# EAGLE schematic JKW_standalone (EAGLE 6.4)
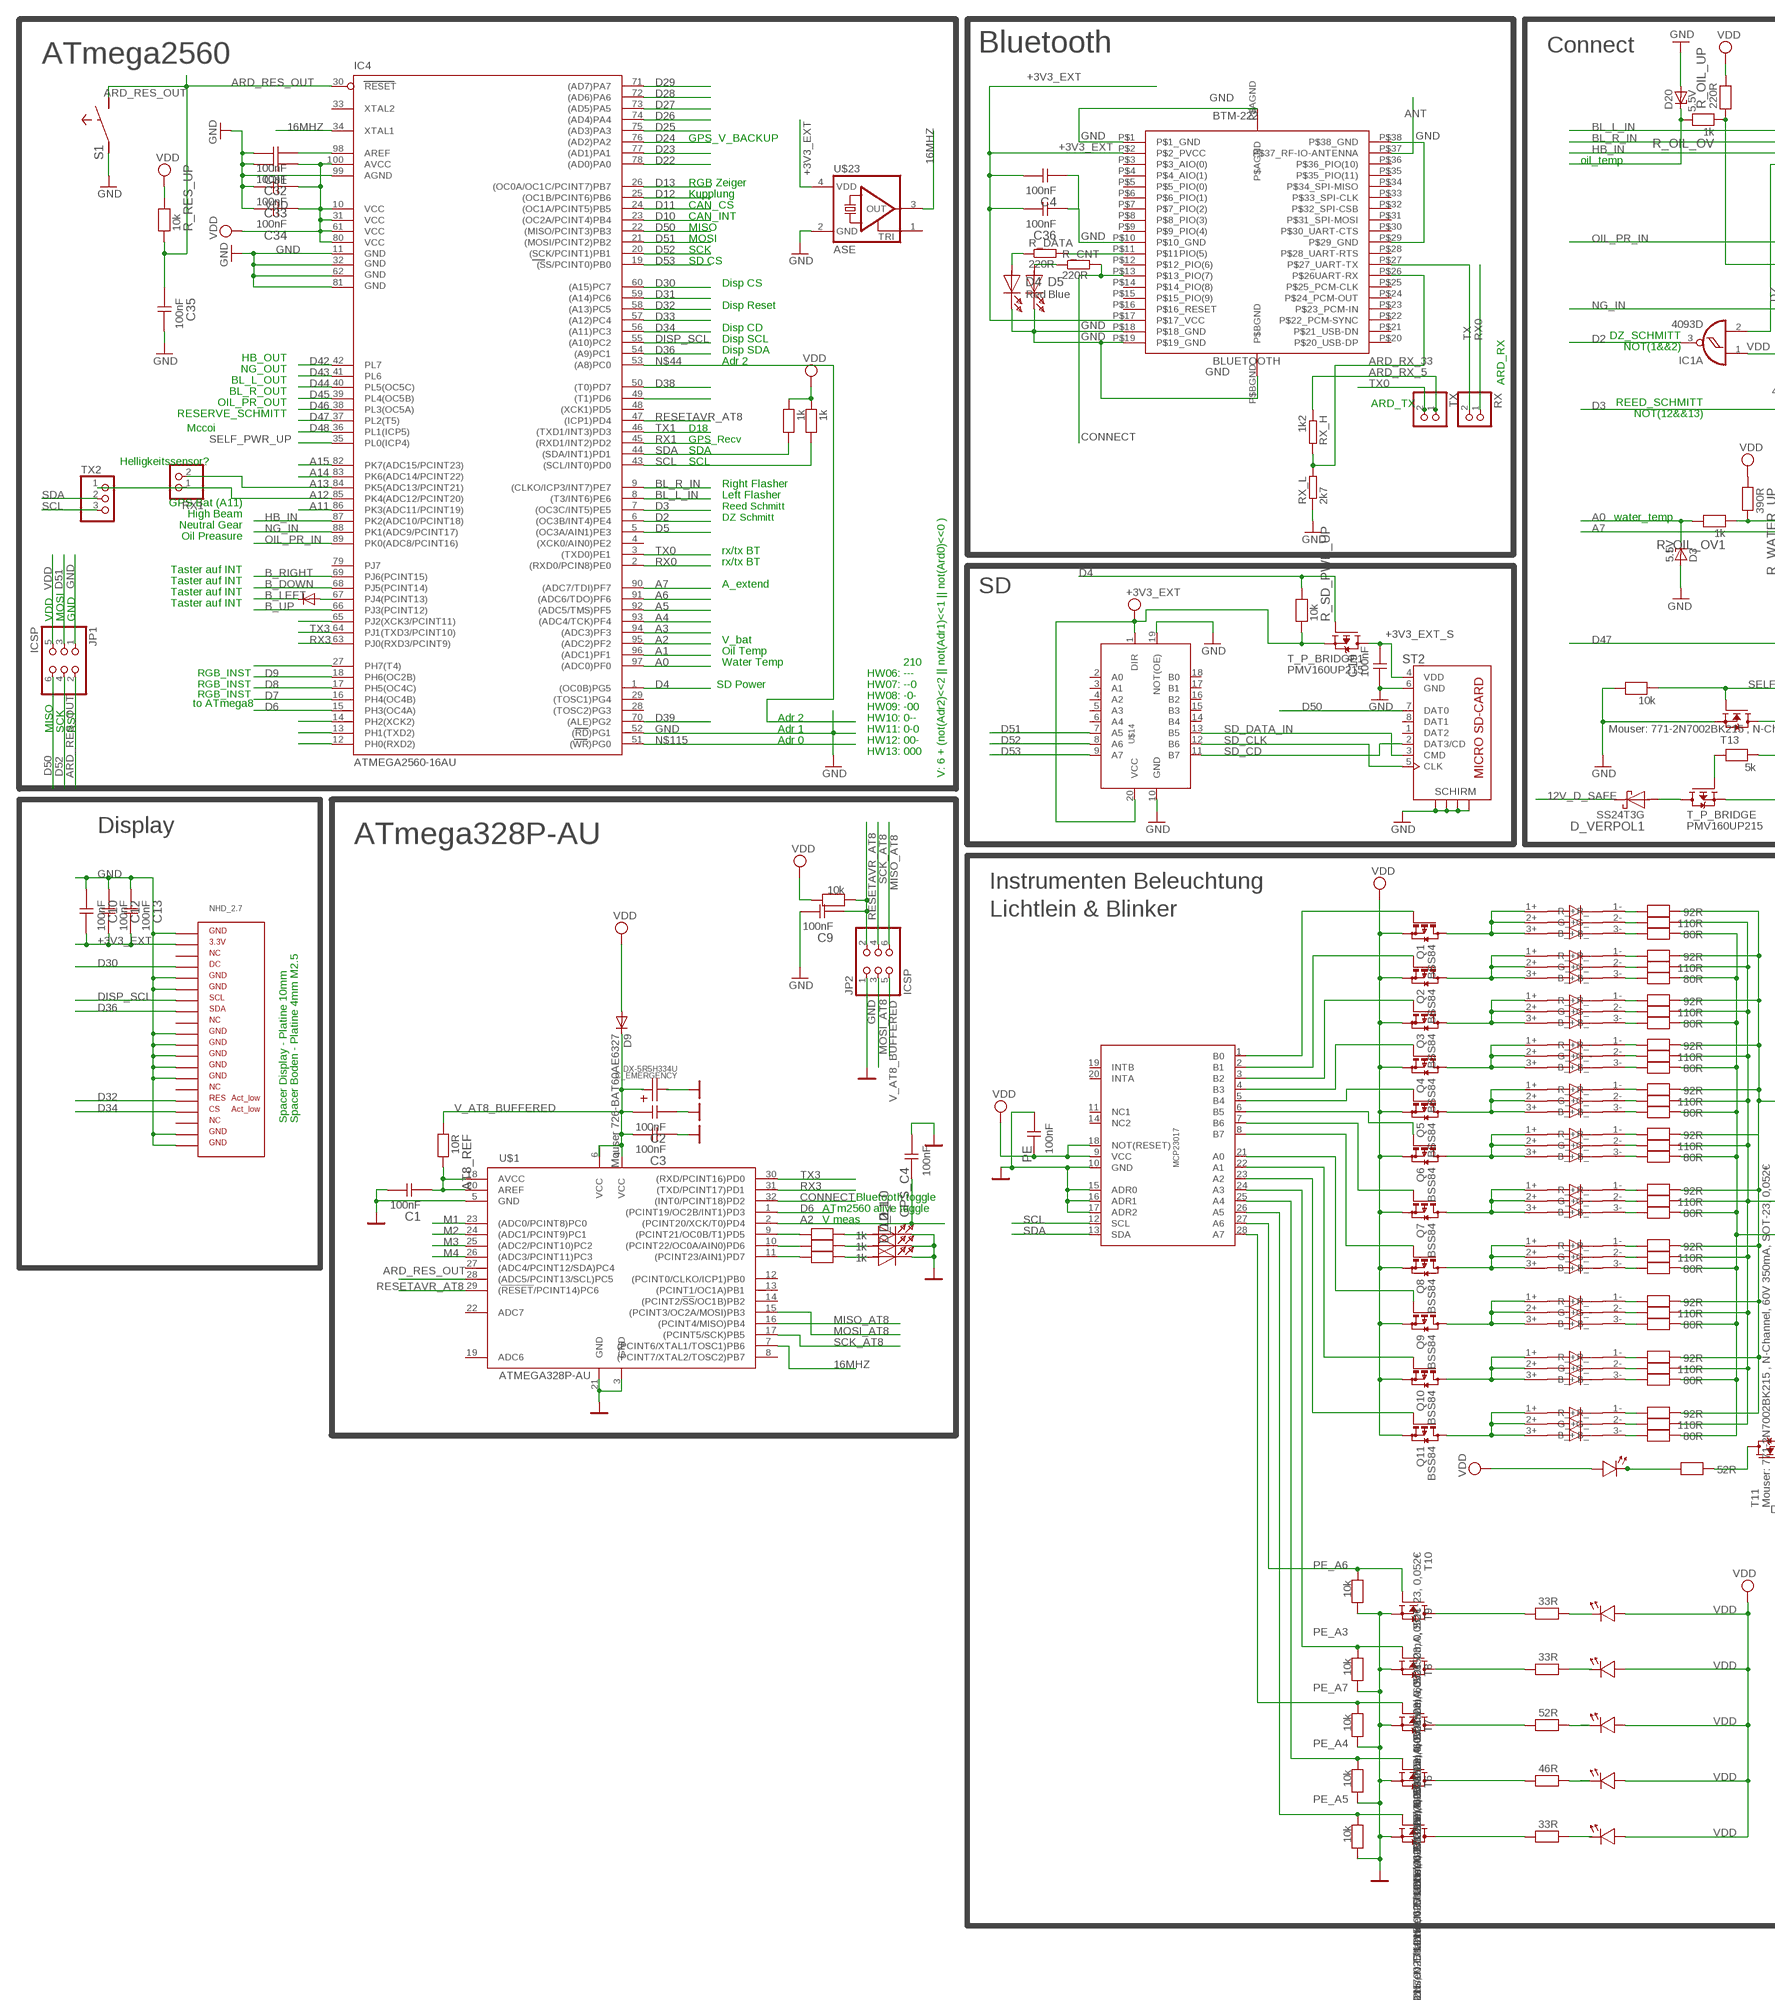
[diagram p0: schematic, sheet 1, part 1 of 3]
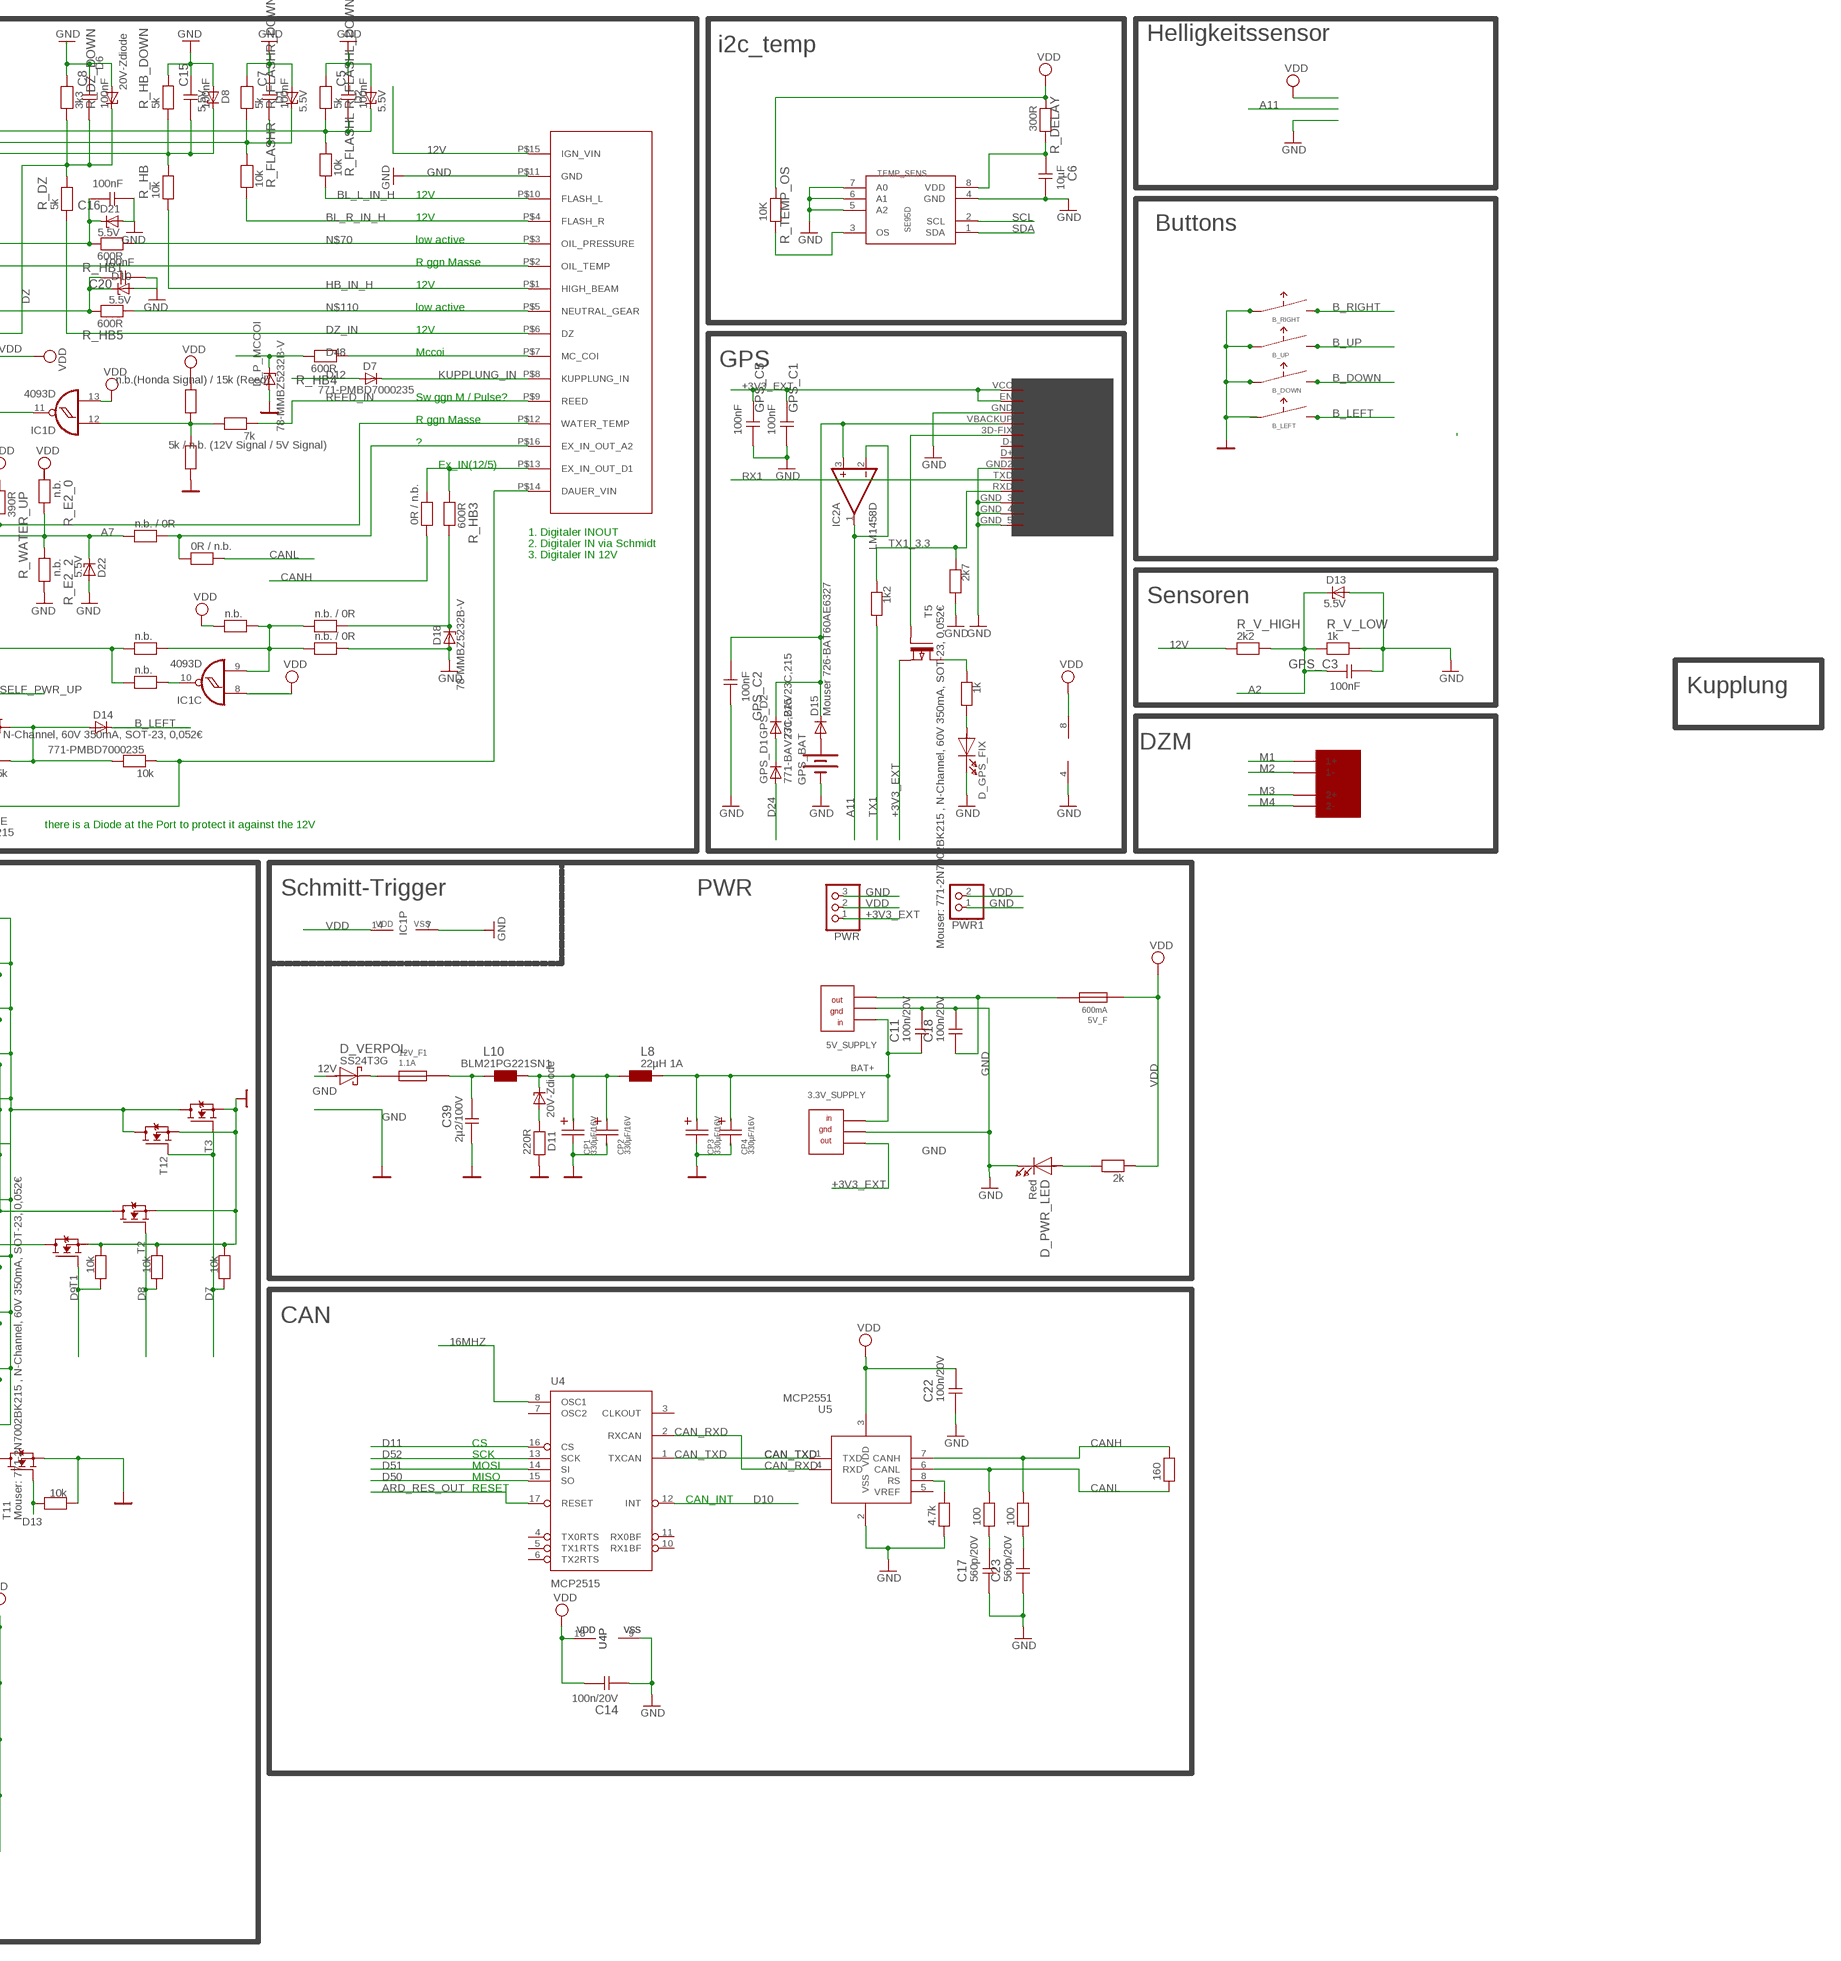
[diagram p1: schematic, sheet 1, part 2 of 3]
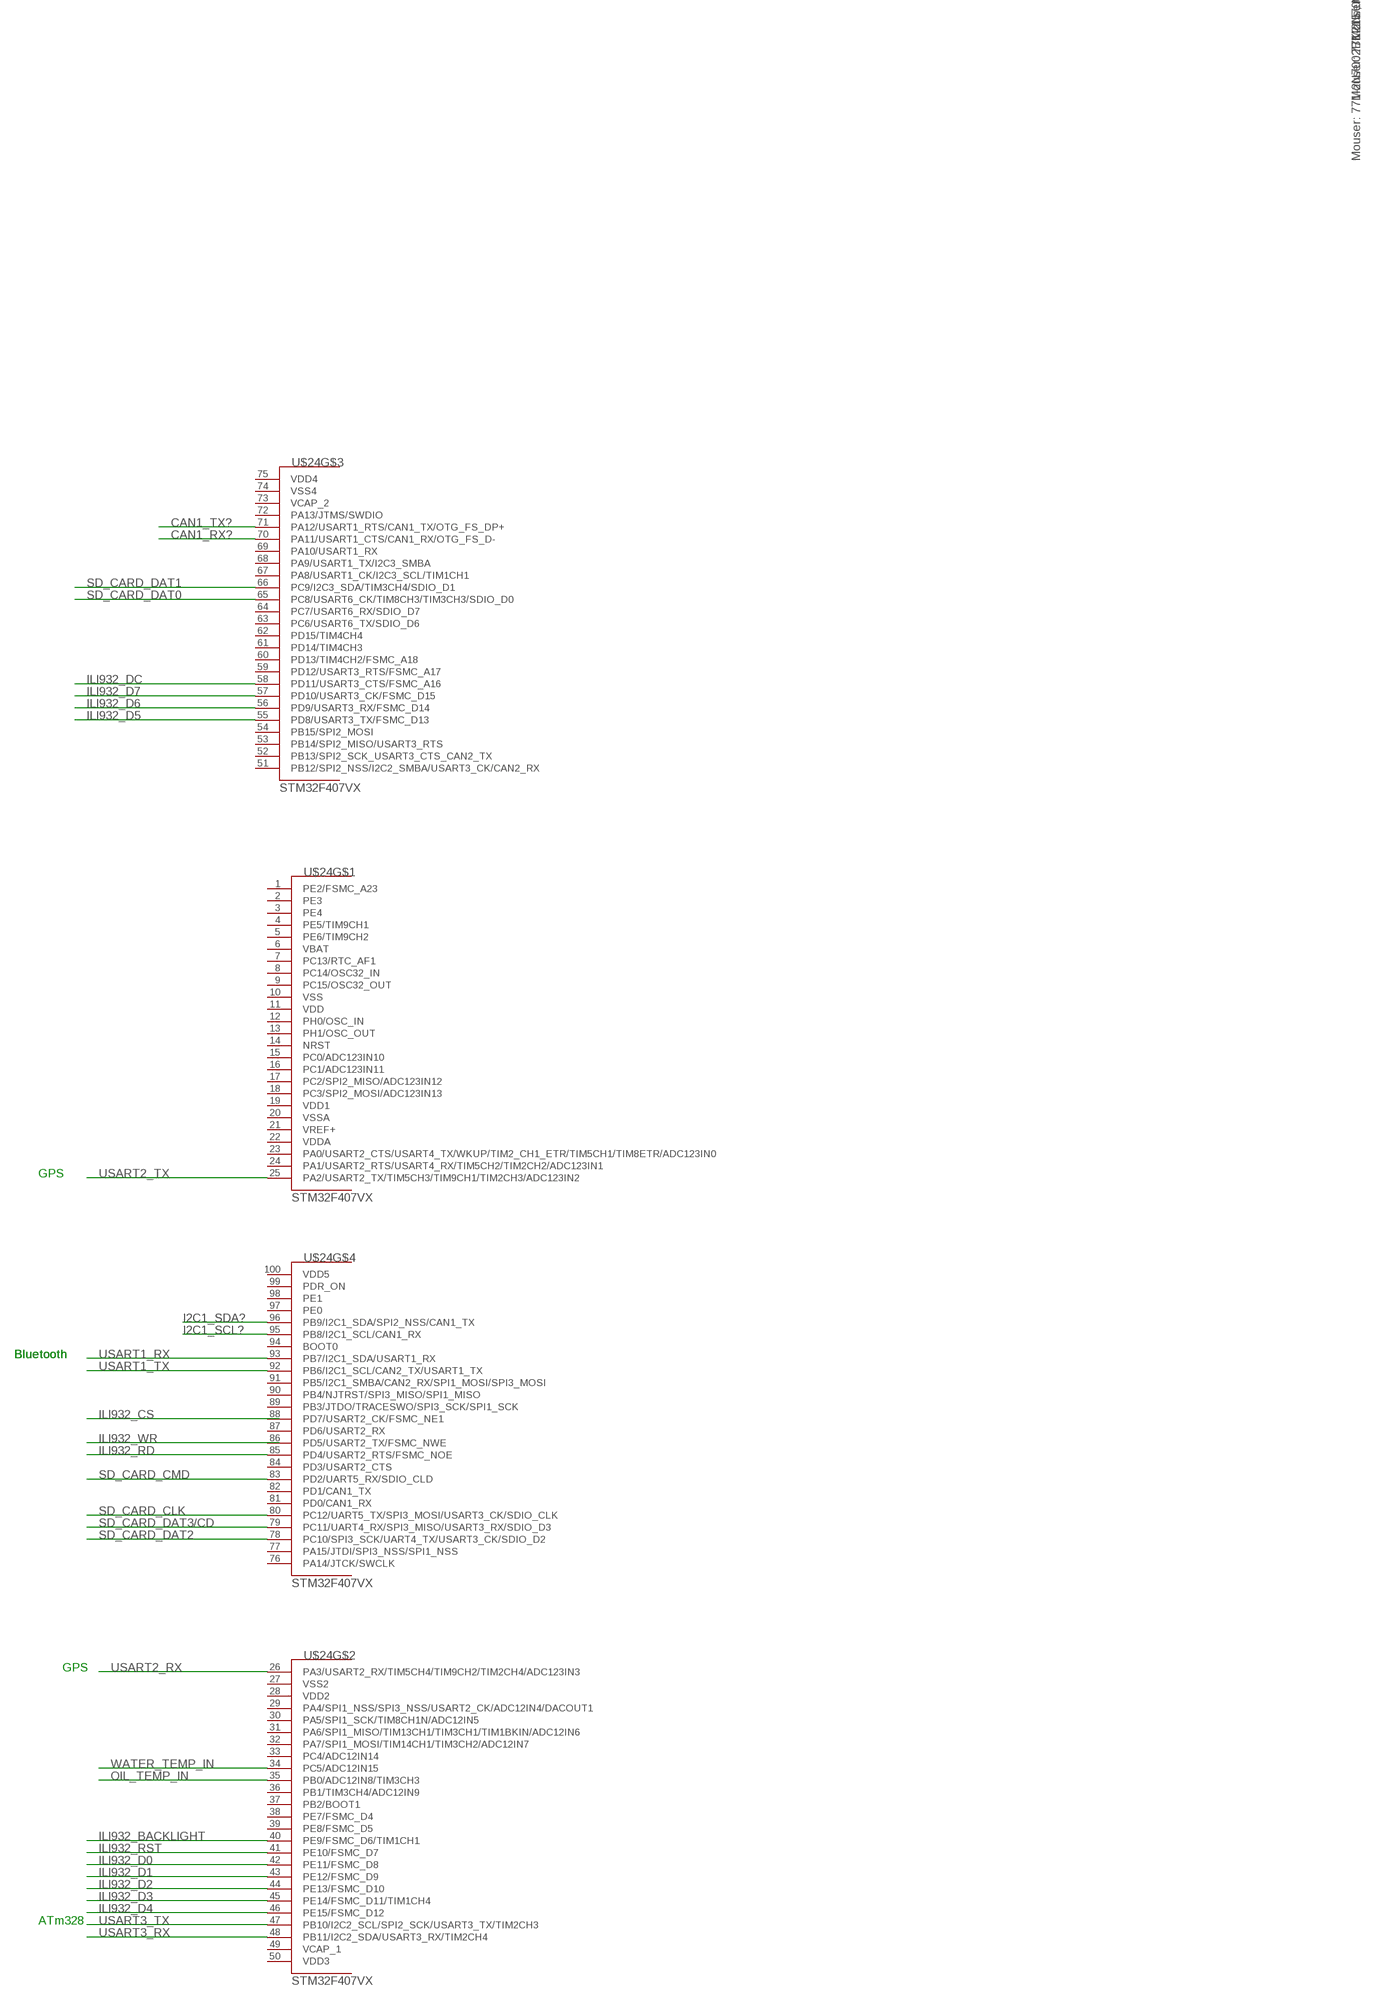
[diagram p2: schematic, sheet 1, part 3 of 3]

## Parts
3.3V_SUPPLY  OKI78SR3.31.5WHC  OKI-78SR  [OKI-78SR]
5V_F  600mA  POLY_FUSE  [POLY_FUSE]
5V_SUPPLY  OKI78SR51.5W36HC  OKI-78SR  [OKI-78SR]
12V_F1  1.1A  POLY_FUSE  [POLY_FUSE]
AT8_REF  10R  R0805  [0805]
B_DOWN  SMD_TASTER_MIT_KAPPE  [SMD_DRUCKTASTER]
B_LEFT  SMD_TASTER_MIT_KAPPE  [SMD_DRUCKTASTER]
B_RIGHT  SMD_TASTER_MIT_KAPPE  [SMD_DRUCKTASTER]
B_UP  SMD_TASTER_MIT_KAPPE  [SMD_DRUCKTASTER]
BLUETOOTH  BTM-222  [BTM-222]
C1  100nF  C0805  [0805]
C2  100nF  C0805  [0805]
C3  100nF  C0805  [0805]
C4  100nF  C0805  [0805]
C5  100nF  C0805  [0805]
C6  10µF  C0805  [0805]
C7  100nF  C0805  [0805]
C8  100nF  C0805  [0805]
C9  100nF  C0805  [0805]
C10  100nF  C0805  [0805]
C11  100n/20V  C0805  [0805]
C12  100nF  C0805  [0805]
C13  100nF  C0805  [0805]
C14  100n/20V  C0805  [0805]
C15  100nF  C0805  [0805]
C16  100nF  C0805  [0805]
C17  560p/20V  C0805  [0805]
C18  100n/20V  C0805  [0805]
C19  100nF  C0805  [0805]
C20  100nF  C0805  [0805]
C22  100n/20V  C0805  [0805]
C23  560p/20V  C0805  [0805]
C31  100nF  C0805  [0805]
C32  100nF  C0805  [0805]
C33  100nF  C0805  [0805]
C34  100nF  C0805  [0805]
C35  100nF  C0805  [0805]
C36  100nF  C0805  [0805]
C39  2µ2/100V  C0805  [0805]
C_EMERGENCY  DX-5R5H334U  [GOLDCAP]
CP1  330µF/16V  C_SMD_SMP  [SMD/SMT_6.6/6.6]
CP2  330µF/16V  C_SMD_SMP  [SMD/SMT_6.6/6.6]
CP3  330µF/16V  C_SMD_SMP  [SMD/SMT_6.6/6.6]
CP4  330µF/16V  C_SMD_SMP  [SMD/SMT_6.6/6.6]
D1  5.5V  ZENER-DIODESOT23  [SOT23]
D2  5.5V  ZENER-DIODESOT23  [SOT23]
D3  5.5V  ZENER-DIODESOT23  [SOT23]
D4  Red  LED0805  [LED-0805]
D5  Blue  LED0805  [LED-0805]
D6  20V-Zdiode  ZENER-DIODESOT23  [SOT23]
D7  771-PMBD7000235  D-A1-C3  [SOT23]
D8  5.5V  ZENER-DIODESOT23  [SOT23]
D9  Mouser 726-BAT60AE6327  DIODE-SOD323-W  [SOD323-W]
D10  5.5V  ZENER-DIODESOT23  [SOT23]
D11  20V-Zdiode  ZENER-DIODESOT23  [SOT23]
D12  771-PMBD7000235  D-A1-C3  [SOT23]
D13  5.5V  ZENER-DIODESOT23  [SOT23]
D14  771-PMBD7000235  D-A1-C3  [SOT23]
D15  Mouser 726-BAT60AE6327  DIODE-SOD323-W  [SOD323-W]
D18  78-MMBZ5232B-V  ZENER-DIODESOT23  [SOT23]
D20  5.5V  ZENER-DIODESOT23  [SOT23]
D21  5.5V  ZENER-DIODESOT23  [SOT23]
D22  5.5V  ZENER-DIODESOT23  [SOT23]
D_GPS_FIX  Red  LED0805  [LED-0805]
D_GR_BLR  PLCC4_LED  [PLCC-4]
D_GR_N  PLCC4_LED  [PLCC-4]
D_L0  LED0805  [LED-0805]
D_L1  LED0805  [LED-0805]
D_L2  LED0805  [LED-0805]
D_P_MCCOI  78-MMBZ5232B-V  ZENER-DIODESOT23  [SOT23]
D_PWR_LED  Red  LED0805  [LED-0805]
D_VERPOL  SS24T3G  D-SSMB-A+K  [SMB]
D_VERPOL1  SS24T3G  D-SSMB-A+K  [SMB]
GPS  MT3329  [MT3329]
GPS_BAT  F_908642  BATTERY12MM  [BATTCON_12MM]
GPS_C1  100nF  C0805  [0805]
GPS_C2  100nF  C0805  [0805]
GPS_C3  100nF  C0805  [0805]
GPS_C4  100nF  C0805  [0805]
GPS_C5  100nF  C0805  [0805]
GPS_D1  771-BAV23C,215  D-A1-C3  [SOT23]
GPS_D2  771-BAV23C,215  D-A1-C3  [SOT23]
IC1  4093D  [SO14]
IC2  LM1458D  [SO08]
IC4  ATMEGA2560-16AU  [TQFP100]
JP1  ICSP  PINHD-2X3  [2X03]
JP2  ICSP  PINHD-2X3  [2X03]
L8  22µH 1A  LPD54  [L-PD54]
L10  BLM21PG221SN1  L0808+0603  [0805+603]
NHD_2.7  NHD_2.7_SOLO_RO  [NHD_2.7_SOLO_RO]
PE  100nF  C0805  [0805]
PWR  PINHD-1X3  [1X03]
PWR1  PINHD-1X2  [1X02]
Q1  BSS84  [SOT23]
Q2  BSS84  [SOT23]
Q3  BSS84  [SOT23]
Q4  BSS84  [SOT23]
Q5  BSS84  [SOT23]
Q6  BSS84  [SOT23]
Q7  BSS84  [SOT23]
Q8  BSS84  [SOT23]
Q9  BSS84  [SOT23]
Q10  BSS84  [SOT23]
Q11  BSS84  [SOT23]
R1  160  R0805  [0805]
R10  100  R0805  [0805]
R12  100  R0805  [0805]
R13  4.7k  R0805  [0805]
R_B_LED_1  80R  R0805  [0805]
R_B_LED_2  80R  R0805  [0805]
R_B_LED_3  80R  R0805  [0805]
R_B_LED_4  80R  R0805  [0805]
R_B_LED_5  80R  R0805  [0805]
R_B_LED_6  80R  R0805  [0805]
R_B_LED_7  80R  R0805  [0805]
R_B_LED_8  80R  R0805  [0805]
R_B_LED_9  80R  R0805  [0805]
R_B_LED_10  80R  R0805  [0805]
R_B_LED_11  80R  R0805  [0805]
R_B_LED_12  10k  R0805  [0805]
R_B_LED_13  10k  R0805  [0805]
R_B_LED_14  10k  R0805  [0805]
R_B_LED_15  10k  R0805  [0805]
R_B_LED_16  10k  R0805  [0805]
R_B_LED_17  10k  R0805  [0805]
R_B_LED_18  10k  R0805  [0805]
R_B_LED_19  10k  R0805  [0805]
R_B_LED_20  10k  R0805  [0805]
R_BL_L  33R  R0805  [0805]
R_BL_R  33R  R0805  [0805]
R_CNT  220R  R-EU_M0805  [M0805]
R_DATA  220R  R-EU_M0805  [M0805]
R_DEAKT_DAUER_P  10k  R0805  [0805]
R_DEAKT_DAUER_P1  10k  R0805  [0805]
R_DEAKT_DAUER_P2  5k  R0805  [0805]
R_DELAY  300R  R0805  [0805]
R_DZ  5k  R0805  [0805]
R_DZ_DOWN  3k3  R0805  [0805]
R_E1_0  n.b.  R0805  [0805]
R_E1_1  n.b. / 0R  R0805  [0805]
R_E1_2  n.b.  R0805  [0805]
R_E1_3  n.b. / 0R  R0805  [0805]
R_E1_4  n.b.  R0805  [0805]
R_E2_0  n.b.  R0805  [0805]
R_E2_1  n.b. / 0R  R0805  [0805]
R_E2_2  n.b.  R0805  [0805]
R_E2_3  0R / n.b.  R0805  [0805]
R_E2_4  0R / n.b.  R0805  [0805]
R_FLASHL  10k  R0805  [0805]
R_FLASHL_DOWN  5k  R0805  [0805]
R_FLASHR  10k  R0805  [0805]
R_FLASHR_DOWN  5k  R0805  [0805]
R_G_LED_1  110R  R0805  [0805]
R_G_LED_2  110R  R0805  [0805]
R_G_LED_3  110R  R0805  [0805]
R_G_LED_4  110R  R0805  [0805]
R_G_LED_5  110R  R0805  [0805]
R_G_LED_6  110R  R0805  [0805]
R_G_LED_7  110R  R0805  [0805]
R_G_LED_8  110R  R0805  [0805]
R_G_LED_9  110R  R0805  [0805]
R_G_LED_10  110R  R0805  [0805]
R_G_LED_11  110R  R0805  [0805]
R_GPS_LED  1k  R0805  [0805]
R_GR_BL_L  PLCC4_LED  [PLCC-4]
R_HB  10k  R0805  [0805]
R_HB1  600R  R0805  [0805]
R_HB3  600R  R0805  [0805]
R_HB4  600R  R0805  [0805]
R_HB5  600R  R0805  [0805]
R_HB_DOWN  5k  R0805  [0805]
R_HIGHB  46R  R0805  [0805]
R_L0  1k  R0805  [0805]
R_L1  1k  R0805  [0805]
R_L2  1k  R0805  [0805]
R_L3  10k  R0805  [0805]
R_LED_5V  2k  R0805  [0805]
R_N  33R  R0805  [0805]
R_OIL  52R  R0805  [0805]
R_OIL_OV  1k  R0805  [0805]
R_OIL_OV1  1k  R0805  [0805]
R_OIL_UP  220R  R0805  [0805]
R_R_LED_0  52R  R0805  [0805]
R_R_LED_1  92R  R0805  [0805]
R_R_LED_2  92R  R0805  [0805]
R_R_LED_3  92R  R0805  [0805]
R_R_LED_4  92R  R0805  [0805]
R_R_LED_5  92R  R0805  [0805]
R_R_LED_6  92R  R0805  [0805]
R_R_LED_7  92R  R0805  [0805]
R_R_LED_8  92R  R0805  [0805]
R_R_LED_9  92R  R0805  [0805]
R_R_LED_10  92R  R0805  [0805]
R_R_LED_11  92R  R0805  [0805]
R_R_LED_12  220R  R0805  [0805]
R_REED  7k  R0805  [0805]
R_REED_DOWN  5k / n.b. (12V Signal / 5V Signal)  R0805  [0805]
R_REED_UP  n.b.(Honda Signal) / 15k (Reed)  R0805  [0805]
R_RES_UP  10k  R0805  [0805]
R_SCL_UP  1k  R0805  [0805]
R_SD_PWR_UP  10k  R0805  [0805]
R_SDA_UP  1k  R0805  [0805]
R_TEMP_OS  10K  R0805  [0805]
R_TX_DOWN  2k7  R0805  [0805]
R_TX_UP  1k2  R0805  [0805]
R_V_HIGH  2k2  R0805  [0805]
R_V_LOW  1k  R0805  [0805]
R_WATER_UP  390R  R0805  [0805]
RGB_1  RGB_LED  [PLCC-6]
RGB_2  RGB_LED  [PLCC-6]
RGB_3  RGB_LED  [PLCC-6]
RGB_4  RGB_LED  [PLCC-6]
RGB_5  RGB_LED  [PLCC-6]
RGB_6  RGB_LED  [PLCC-6]
RGB_7  RGB_LED  [PLCC-6]
RGB_8  RGB_LED  [PLCC-6]
RGB_9  RGB_LED  [PLCC-6]
RGB_10  RGB_LED  [PLCC-6]
RGB_11  RGB_LED  [PLCC-6]
RX  PINHD-1X2  [1X02]
RX1  PINHD-1X2  [1X02]
RX_H  1k2  R-EU_M0805  [M0805]
RX_L  2k7  R-EU_M0805  [M0805]
S1  SW-TASTERECO-DIAGONAL  [SW-ECO]
SPEEDOSTECKER  SPEEDOSTECKER  [SPEEDOSTECKER]
ST2  SD_MICRO  [SD_MICRO]
STEPPER  STEPPER  [STEPPER]
T1  Mouser: 771-2N7002BK215 , N-Channel, 60V 350mA, SOT-23, 0,052€  2N7002  [SOT23]
T2  Mouser: 771-2N7002BK215 , N-Channel, 60V 350mA, SOT-23, 0,052€  2N7002  [SOT23]
T3  Mouser: 771-2N7002BK215 , N-Channel, 60V 350mA, SOT-23, 0,052€  2N7002  [SOT23]
T5  Mouser: 771-2N7002BK215 , N-Channel, 60V 350mA, SOT-23, 0,052€  T-P-FETBSS139  [SOT-23]
T6  Mouser: 771-2N7002BK215 , N-Channel, 60V 350mA, SOT-23, 0,052€  2N7002  [SOT23]
T7  Mouser: 771-2N7002BK215 , N-Channel, 60V 350mA, SOT-23, 0,052€  2N7002  [SOT23]
T8  Mouser: 771-2N7002BK215 , N-Channel, 60V 350mA, SOT-23, 0,052€  2N7002  [SOT23]
T9  Mouser: 771-2N7002BK215 , N-Channel, 60V 350mA, SOT-23, 0,052€  2N7002  [SOT23]
T10  Mouser: 771-2N7002BK215 , N-Channel, 60V 350mA, SOT-23, 0,052€  2N7002  [SOT23]
T11  Mouser: 771-2N7002BK215 , N-Channel, 60V 350mA, SOT-23, 0,052€  2N7002  [SOT23]
T12  Mouser: 771-2N7002BK215 , N-Channel, 60V 350mA, SOT-23, 0,052€  2N7002  [SOT23]
T13  Mouser: 771-2N7002BK215 , N-Channel, 60V 350mA, SOT-23, 0,052€  2N7002  [SOT23]
T_P_BRIDGE  PMV160UP215  [SOT23]
T_P_BRIDGE1  PMV160UP215  [SOT23]
TEMP_SENS  SE95D  [SOIC8]
TX  PINHD-1X2  [1X02]
TX2  PINHD-1X3  [1X03]
U4  MCP2515  MCP2510SO  [SO-18W]
U5  MCP2551  [SO-08M]
U$1  ATMEGA328P-AU  [TQFP8]
U$3  CLM4B-BKW-CTBVA363  [PLCC-4]
U$11  CLM4B-RKW-CWAXBAA3  [PLCC-4]
U$14  74LVC_LVCH245A  [TSSOP20]
U$19  MCP23017  [SOIC28]
U$22  CLM4B-RKW-CWAXBAA3  [PLCC-4]
U$23  ASE  [ASE]
U$24  STM32F407VX  [LQFP100]

## Nets
3D-FIX: GPS.3D-FIX T5.1(G)
12V: D_VERPOL.A R_V_HIGH.1 SPEEDOSTECKER.P$15(IGN_VIN)
12V_D_SAFE: 12V_F1.P$1 D_VERPOL1.K D_VERPOL.K
12V_PERMANENT: R_DEAKT_DAUER_P.1 SPEEDOSTECKER.P$14(DAUER_VIN) T_P_BRIDGE.2(S)
12V_SAFE: 12V_F1.P$2 C39.1 L10.1
16MHZ: IC4.34(XTAL1) U4.8(OSC1) U$1.7((PCINT6/XTAL1/TOSC1)PB6) U$23.3(OUT)
+3V3_EXT: 3.3V_SUPPLY.OUT BLUETOOTH.P$2(P$2_PVCC) BLUETOOTH.P$17(P$17_VCC) C4.2 C10.2 C12.2 C13.2 C36.2 GPS.EN GPS.VCC GPS_C1.2 GPS_C5.2 NHD_2.7.VDD0(VDD) PWR.1 R_SD_PWR_UP.1 T5.2(S) T_P_BRIDGE1.2(S) U$14.1(DIR) U$14.20(VCC)
+3V3_EXT_S: C19.2 ST2.4(VDD) T_P_BRIDGE1.3(D)
A0: D3.3(C) IC4.97((ADC0)PF0) R_OIL_OV1.2
A1: D20.3(C) IC4.96((ADC1)PF1) R_OIL_OV.2
A2: D13.3(C) GPS_C3.2 GPS_C4.2 IC4.95((ADC2)PF2) R_V_HIGH.2 R_V_LOW.1 U$1.2((PCINT20/XCK/T0)PD4)
A3: IC4.94((ADC3)PF3)
A4: IC4.93((ADC4/TCK)PF4)
A5: IC4.92((ADC5/TMS)PF5)
A6: IC4.91((ADC6/TDO)PF6)
A7: D22.3(C) IC4.90((ADC7/TDI)PF7) R_E2_0.2 R_E2_1.2 R_E2_2.1
A11: IC2.1(A:OUT) IC2.2(A:-IN) IC4.86(PK3(ADC11/PCINT19))
A12: IC4.85(PK4(ADC12/PCINT20)) RX1.1 TX2.1
A13: IC4.84(PK5(ADC13/PCINT21)) RX1.2
A14: IC4.83(PK6(ADC14/PCINT22))
A15: IC4.82(PK7(ADC15/PCINT23))
ANT: BLUETOOTH.P$37(P$37_RF-IO-ANTENNA)
ARD_RES_OUT: C35.1 IC4.30(RESET) JP1.2 R_RES_UP.1 S1.4 U4.17(RESET) U$1.28((ADC5/PCINT13/SCL)PC5)
ARD_RX_5: RX_H.1 TX.1
ARD_RX_33: BLUETOOTH.P$26(P$26UART-RX) RX_H.2 RX_L.2
B_DOWN: B_DOWN.OUT IC4.68(PJ5(PCINT14))
B_LEFT: B_LEFT.OUT D12.3(C) D14.3(C)
B_RIGHT: B_RIGHT.OUT IC4.69(PJ6(PCINT15))
B_UP: B_UP.OUT IC4.66(PJ3(PCINT12))
BAT+: 3.3V_SUPPLY.IN 5V_SUPPLY.IN C11.1 CP3.POS(PLUS) CP4.POS(PLUS) L8.2
BL_L_IN: C5.1 D2.3(C) IC4.8((T3/INT6)PE6) R_FLASHL.2 R_FLASHL_DOWN.1
BL_L_IN_H: R_FLASHL.1 SPEEDOSTECKER.P$10(FLASH_L)
BL_R_IN: C7.1 D1.3(C) IC4.9((CLKO/ICP3/INT7)PE7) R_FLASHR.2 R_FLASHR_DOWN.1
BL_R_IN_H: R_FLASHR.1 SPEEDOSTECKER.P$4(FLASH_R)
BLUE_INSTR: R_B_LED_1.2 R_B_LED_2.2 R_B_LED_3.2 R_B_LED_4.2 R_B_LED_5.2 R_B_LED_6.2 R_B_LED_7.2 R_B_LED_8.2 R_B_LED_9.2 R_B_LED_10.2 R_B_LED_11.2 T1.3(D)
CAN1_RX?: U$24.70(PA11/USART1_CTS/CAN1_RX/OTG_FS_D-)
CAN1_TX?: U$24.71(PA12/USART1_RTS/CAN1_TX/OTG_FS_DP+)
CAN_RXD: U4.2(RXCAN) U5.4(RXD)
CAN_TXD: U4.1(TXCAN) U5.1(TXD)
CANH: R1.2 R12.2 R_E2_4.2 U5.7(CANH)
CANL: R1.1 R10.2 R_E2_3.1 U5.6(CANL)
CONNECT: BLUETOOTH.P$13(P$13_PIO(7)) R_CNT.2 U$1.32((INT0/PCINT18)PD2)
D2: IC1.3(A:O) IC4.6((OC3B/INT4)PE4)
D3: IC1.11(D:O) IC4.7((OC3C/INT5)PE5)
D4: IC4.1((OC0B)PG5) R_SD_PWR_UP.2 T_P_BRIDGE1.1(G)
D5: IC4.5((OC3A/AIN1)PE3)
D6: IC4.15(PH3(OC4A)) U$1.1((PCINT19/OC2B/INT1)PD3)
D7: IC4.16(PH4(OC4B)) R_B_LED_15.1 T3.1(G) T12.1(G)
D8: IC4.17(PH5(OC4C)) R_B_LED_14.1 T2.1(G)
D9: IC4.18(PH6(OC2B)) R_B_LED_13.1 T1.1(G)
D10: IC4.23((OC2A/PCINT4)PB4) U4.12(INT)
D11: IC4.24((OC1A/PCINT5)PB5) U4.16(CS)
D12: D7.1(A) IC4.25((OC1B/PCINT6)PB6)
D13: IC4.26((OC0A/OC1C/PCINT7)PB7) R_B_LED_12.1 T11.1(G)
D22: IC4.78((AD0)PA0)
D23: IC4.77((AD1)PA1)
D24: GPS_D1.1(A) IC4.76((AD2)PA2)
D25: IC4.75((AD3)PA3)
D26: IC4.74((AD4)PA4)
D27: IC4.73((AD5)PA5)
D28: IC4.72((AD6)PA6)
D29: IC4.71((AD7)PA7)
D30: IC4.60((A15)PC7) NHD_2.7.DC
D31: IC4.59((A14)PC6)
D32: IC4.58((A13)PC5) NHD_2.7.RES
D33: IC4.57((A12)PC4)
D34: IC4.56((A11)PC3) NHD_2.7.CS
D36: IC4.54((A9)PC1) NHD_2.7.SDIN(SDA)
D38: IC4.50((T0)PD7)
D39: IC4.70((ALE)PG2)
D42: IC4.42(PL7)
D43: IC4.41(PL6)
D44: IC4.40(PL5(OC5C))
D45: IC4.39(PL4(OC5B))
D46: IC4.38(PL3(OC5A))
D47: IC4.37(PL2(T5)) R_E1_2.2 R_E1_4.2
D48: D_P_MCCOI.3(C) IC4.36(PL1(ICP5)) R_HB4.2
D50: IC4.22((MISO/PCINT3)PB3) JP1.6 ST2.7(DAT0) U4.15(SO)
D51: IC4.21((MOSI/PCINT2)PB2) JP1.3 U4.14(SI) U$14.7(A5)
D52: IC4.20((SCK/PCINT1)PB1) JP1.4 U4.13(SCK) U$14.8(A6)
D53: IC4.19((SS/PCINT0)PB0) U$14.9(A7)
DISP_SCL: IC4.55((A10)PC2) NHD_2.7.SCLK(SCL)
DZ: C8.1 D6.3(C) IC1.2(A:I1) R_DZ.2 R_DZ_DOWN.1
DZ_IN: R_DZ.1 SPEEDOSTECKER.P$6(DZ)
GND: 3.3V_SUPPLY.GND 5V_SUPPLY.GND B_DOWN.IN B_DOWN.IN2(IN) B_LEFT.IN B_LEFT.IN2(IN) B_RIGHT.IN B_RIGHT.IN2(IN) B_UP.IN B_UP.IN2(IN) BLUETOOTH.P$1(P$1_GND) BLUETOOTH.P$10(P$10_GND) BLUETOOTH.P$18(P$18_GND) BLUETOOTH.P$19(P$19_GND) BLUETOOTH.P$29(P$29_GND) BLUETOOTH.P$38(P$38_GND) BLUETOOTH.P$AGND BLUETOOTH.P$BGND C1.2 C2.1 C3.1 C4.1 C5.2 C6.2 C7.2 C8.2 C9.2 C10.1 C11.2 C12.1 C13.1 C14.1 C15.2 C16.1 C17.1 C18.2 C19.1 C20.1 C22.1 C23.1 C31.2 C32.2 C33.2 C34.2 C35.2 C36.1 C39.2 C_EMERGENCY.MINUS(GND) CP1.NEG(GND) CP2.NEG(GND) CP3.NEG(GND) CP4.NEG(GND) D1.1(A) D2.1(A) D3.1(A) D4.2(K) D5.2(K) D6.1(A) D8.1(A) D10.1(A) D13.1(A) D18.1(A) D20.1(A) D21.1(A) D22.1(A) D_GPS_FIX.2(K) D_L0.2(K) D_L1.2(K) D_L2.2(K) D_P_MCCOI.1(A) D_PWR_LED.2(K) GPS.GND GPS.GND2 GPS.GND_3 GPS.GND_4 GPS.GND_5 GPS_BAT.GND(-) GPS_C1.1 GPS_C2.2 GPS_C3.1 GPS_C4.1 GPS_C5.1 IC1.7(P:VSS) IC2.4(P:V-) IC4.11(GND) IC4.32(GND1) IC4.52((RD)PG1) IC4.62(GND2) IC4.81(GND3) IC4.99(AGND) JP1.1 JP2.1 NHD_2.7.GND0(GND) NHD_2.7.GND1(GND2) NHD_2.7.GND2(GND3) NHD_2.7.GND3(GND4) NHD_2.7.GND4(GND5) NHD_2.7.GND5(GND6) NHD_2.7.GND6(GND7) NHD_2.7.GND7(GND8) NHD_2.7.GND8(GND9) NHD_2.7.GND9(GND10) PE.1 PWR1.1 PWR.3 R13.1 R_B_LED_12.2 R_B_LED_13.2 R_B_LED_14.2 R_B_LED_15.2 R_B_LED_16.1 R_B_LED_17.1 R_B_LED_18.1 R_B_LED_19.1 R_B_LED_20.1 R_DEAKT_DAUER_P1.2 R_DZ_DOWN.2 R_E1_3.1 R_E2_2.2 R_FLASHL_DOWN.2 R_FLASHR_DOWN.2 R_HB_DOWN.2 R_R_LED_12.1 R_REED_DOWN.2 R_TX_DOWN.2 R_V_LOW.2 RX_L.1 S1.1 SPEEDOSTECKER.P$11(GND) ST2.6(GND) ST2.GND2(SCHIRM2) ST2.GND3(SCHIRM3) ST2.GND4(SCHIRM) ST2.GND(SCHIRM1) T1.2(S) T2.2(S) T3.2(S) T6.2(S) T7.2(S) T8.2(S) T9.2(S) T10.2(S) T11.2(S) T12.2(S) T13.2(S) TEMP_SENS.4(GND) TEMP_SENS.5(A2) TEMP_SENS.6(A1) TEMP_SENS.7(A0) U4.9(VSS) U5.2(VSS) U$1.3(GND) U$1.5(GND) U$1.21(GND) U$14.10(GND) U$14.19(NOT(OE)) U$19.10(GND) U$19.15(ADR0) U$19.16(ADR1) U$19.17(ADR2) U$23.2(GND)
GREEN_INSTR: R_G_LED_1.2 R_G_LED_2.2 R_G_LED_3.2 R_G_LED_4.2 R_G_LED_5.2 R_G_LED_6.2 R_G_LED_7.2 R_G_LED_8.2 R_G_LED_9.2 R_G_LED_10.2 R_G_LED_11.2 T2.3(D)
HB_IN: C15.1 D8.3(C) IC4.87(PK2(ADC10/PCINT18)) R_HB.2 R_HB_DOWN.1
HB_IN_H: R_HB.1 SPEEDOSTECKER.P$1(HIGH_BEAM)
I2C1_SCL?: U$24.95(PB8/I2C1_SCL/CAN1_RX)
I2C1_SDA?: U$24.96(PB9/I2C1_SDA/SPI2_NSS/CAN1_TX)
ILI932_BACKLIGHT: U$24.40(PE9/FSMC_D6/TIM1CH1)
ILI932_D0: U$24.42(PE11/FSMC_D8)
ILI932_D1: U$24.43(PE12/FSMC_D9)
ILI932_D2: U$24.44(PE13/FSMC_D10)
ILI932_D3: U$24.45(PE14/FSMC_D11/TIM1CH4)
ILI932_D4: U$24.46(PE15/FSMC_D12)
ILI932_D5: U$24.55(PD8/USART3_TX/FSMC_D13)
ILI932_D6: U$24.56(PD9/USART3_RX/FSMC_D14)
ILI932_D7: U$24.57(PD10/USART3_CK/FSMC_D15)
ILI932_DC: U$24.58(PD11/USART3_CTS/FSMC_A16)
ILI932_RD: U$24.85(PD4/USART2_RTS/FSMC_NOE)
ILI932_RST: U$24.41(PE10/FSMC_D7)
KUPPLUNG_IN: D7.3(C) SPEEDOSTECKER.P$8(KUPPLUNG_IN)
M1: STEPPER.1+ U$1.23((ADC0/PCINT8)PC0)
M2: STEPPER.1- U$1.24((ADC1/PCINT9)PC1)
M3: STEPPER.2+ U$1.25((ADC2/PCINT10)PC2)
M4: STEPPER.2- U$1.26((ADC3/PCINT11)PC3)
MISO_AT8: JP2.6 U$1.16((PCINT4/MISO)PB4)
MOSI_AT8: JP2.3 U$1.15((PCINT3/OC2A/MOSI)PB3)
N999: R_OIL_OV.1 R_OIL_UP.1 SPEEDOSTECKER.P$2(OIL_TEMP)
N$1: CP1.POS(PLUS) CP2.POS(PLUS) D11.3(C) L8.1 L10.2
N$3: AT8_REF.2 C1.1 U$1.18(AVCC) U$1.20(AREF)
N$4: C6.1 R_DELAY.1 TEMP_SENS.8(VDD)
N$5: D5.1(A) R_CNT.1
N$6: R_B_LED_4.1 RGB_5.3-(B_-)
N$7: R_G_LED_4.1 RGB_5.2-(G_-)
N$8: R_R_LED_4.1 RGB_5.1-(R_-)
N$9: D_PWR_LED.1(A) R_LED_5V.2
N$10: R_B_LED_5.1 RGB_6.3-(B_-)
N$11: D15.A GPS_BAT.PWR@1(+)
N$12: D4.1(A) R_DATA.1
N$13: Q11.3(D) RGB_11.1+(R_+) RGB_11.2+(G_+) RGB_11.3+(B_+)
N$14: R_L2.1 U$1.11((PCINT23/AIN1)PD7)
N$15: D_GPS_FIX.1(A) R_GPS_LED.2
N$16: R_R_LED_0.1 U$22.P$4(CATHODE)
N$17: R_GPS_LED.1 T5.3(D)
N$18: R_L1.1 U$1.10((PCINT22/OC0A/AIN0)PD6)
N$19: 5V_F.P$2 5V_SUPPLY.OUT C18.1
N$20: R_L0.1 U$1.9((PCINT21/OC0B/T1)PD5)
N$21: R_G_LED_5.1 RGB_6.2-(G_-)
N$22: R_R_LED_5.1 RGB_6.1-(R_-)
N$23: Q10.3(D) RGB_10.1+(R_+) RGB_10.2+(G_+) RGB_10.3+(B_+)
N$24: R_DEAKT_DAUER_P2.2 T_P_BRIDGE.1(G)
N$25: R_OIL.1 U$11.P$4(CATHODE)
N$26: Q9.3(D) RGB_1.1+(R_+) RGB_1.2+(G_+) RGB_1.3+(B_+)
N$27: R_B_LED_6.1 RGB_7.3-(B_-)
N$28: R_HIGHB.1 U$3.P$4(CATHODE)
N$29: IC4.49((T1)PD6)
N$30: R_G_LED_6.1 RGB_7.2-(G_-)
N$31: IC4.27(PH7(T4))
N$32: R_R_LED_6.1 RGB_7.1-(R_-)
N$33: R_BL_L.2 T10.3(D)
N$34: R_BL_R.2 T9.3(D)
N$37: C31.1 IC4.98(AREF)
N$38: IC1.9(C:I1) R_E1_0.1 R_E1_1.2 R_E1_2.1 R_E1_3.2
N$39: R_HIGHB.2 T7.3(D)
N$40: IC1.10(C:O) R_E1_4.1
N$41: D12.1(A) IC4.67(PJ4(PCINT13))
N$42: R_E2_4.1 R_HB3.1 SPEEDOSTECKER.P$13(EX_IN_OUT_D1)
N$43: R_E2_1.1 R_E2_3.2 SPEEDOSTECKER.P$16(EX_IN_OUT_A2)
N$44: IC4.53((A8)PC0)
N$45: D_VERPOL1.A T_P_BRIDGE.3(D)
N$46: C17.2 R10.1
N$47: GPS_D1.3(C) GPS_D2.1(A)
N$49: IC4.65(PJ2(XCK3/PCINT11))
N$50: IC4.12(PH0(RXD2))
N$51: R_R_LED_3.1 RGB_4.1-(R_-)
N$52: R_G_LED_3.1 RGB_4.2-(G_-)
N$53: R_B_LED_3.1 RGB_4.3-(B_-)
N$54: R_R_LED_2.1 RGB_3.1-(R_-)
N$55: R_G_LED_2.1 RGB_3.2-(G_-)
N$56: R_B_LED_2.1 RGB_3.3-(B_-)
N$57: R_R_LED_1.1 RGB_2.1-(R_-)
N$58: R_G_LED_1.1 RGB_2.2-(G_-)
N$59: R_B_LED_1.1 RGB_2.3-(B_-)
N$60: IC4.13(PH1(TXD2))
N$61: IC4.14(PH2(XCK2))
N$62: R_BL_L.1 R_GR_BL_L.P$4(CATHODE)
N$64: R_R_LED_7.1 RGB_11.1-(R_-)
N$66: D_GR_BLR.P$4(CATHODE) R_BL_R.1
N$67: R_N.2 T6.3(D)
N$68: R_OIL.2 T8.3(D)
N$69: D_GR_N.P$4(CATHODE) R_N.1
N$70: R_HB1.1 SPEEDOSTECKER.P$3(OIL_PRESSURE)
N$71: R_R_LED_0.2 T11.3(D)
N$72: R_G_LED_7.1 RGB_11.2-(G_-)
N$73: R_B_LED_7.1 RGB_11.3-(B_-)
N$74: R_R_LED_8.1 RGB_10.1-(R_-)
N$75: R_G_LED_8.1 RGB_10.2-(G_-)
N$76: R_B_LED_8.1 RGB_10.3-(B_-)
N$77: R_R_LED_9.1 RGB_9.1-(R_-)
N$78: R_G_LED_9.1 RGB_9.2-(G_-)
N$79: R_B_LED_9.1 RGB_9.3-(B_-)
N$80: R_R_LED_10.1 RGB_8.1-(R_-)
N$81: R_G_LED_10.1 RGB_8.2-(G_-)
N$82: R_B_LED_10.1 RGB_8.3-(B_-)
N$83: R_R_LED_11.1 RGB_1.1-(R_-)
N$84: R_G_LED_11.1 RGB_1.2-(G_-)
N$85: R_B_LED_11.1 RGB_1.3-(B_-)
N$86: Q8.3(D) RGB_8.1+(R_+) RGB_8.2+(G_+) RGB_8.3+(B_+)
N$87: Q7.3(D) RGB_9.1+(R_+) RGB_9.2+(G_+) RGB_9.3+(B_+)
N$88: Q1.3(D) RGB_7.1+(R_+) RGB_7.2+(G_+) RGB_7.3+(B_+)
N$89: C23.2 R12.1
N$90: D18.3(C) R_E1_1.1 R_HB3.2
N$91: R_TEMP_OS.1 TEMP_SENS.3(OS)
N$92: R_HB4.1 SPEEDOSTECKER.P$7(MC_COI)
N$93: Q2.3(D) RGB_6.1+(R_+) RGB_6.2+(G_+) RGB_6.3+(B_+)
N$94: Q3.3(D) RGB_5.1+(R_+) RGB_5.2+(G_+) RGB_5.3+(B_+)
N$95: Q4.3(D) RGB_4.1+(R_+) RGB_4.2+(G_+) RGB_4.3+(B_+)
N$96: Q6.3(D) RGB_2.1+(R_+) RGB_2.2+(G_+) RGB_2.3+(B_+)
N$97: Q5.3(D) RGB_3.1+(R_+) RGB_3.2+(G_+) RGB_3.3+(B_+)
N$98: Q1.1(G) U$19.1(B0)
N$99: Q2.1(G) U$19.2(B1)
N$100: Q3.1(G) U$19.3(B2)
N$101: Q4.1(G) U$19.4(B3)
N$102: Q5.1(G) U$19.5(B4)
N$103: Q6.1(G) U$19.6(B5)
N$104: Q7.1(G) U$19.7(B6)
N$105: Q8.1(G) U$19.8(B7)
N$106: Q9.1(G) U$19.21(A0)
N$107: Q10.1(G) U$19.22(A1)
N$108: Q11.1(G) U$19.23(A2)
N$109: D11.1(A) R_R_LED_12.2
N$110: R_HB5.1 SPEEDOSTECKER.P$5(NEUTRAL_GEAR)
N$111: R_OIL_OV1.1 R_WATER_UP.2 SPEEDOSTECKER.P$12(WATER_TEMP)
N$112: R13.2 U5.8(RS)
N$115: IC4.51((WR)PG0)
NET12: D14.1(A) R_DEAKT_DAUER_P2.1 R_DEAKT_DAUER_P.2 T13.3(D)
NG_IN: C20.2 D10.3(C) IC4.88(PK1(ADC9/PCINT17)) R_HB5.2
OIL_PR_IN: C16.2 D21.3(C) IC4.89(PK0(ADC8/PCINT16)) R_HB1.2
OIL_TEMP_IN: U$24.35(PB0/ADC12IN8/TIM3CH3)
P0: D_L0.1(A) R_L0.2
P1: D_L1.1(A) R_L1.2
P2: D_L2.1(A) R_L2.2
PE_A3: R_B_LED_17.2 T9.1(G) U$19.24(A3)
PE_A4: R_B_LED_19.2 T7.1(G) U$19.25(A4)
PE_A5: R_B_LED_20.2 T6.1(G) U$19.26(A5)
PE_A6: R_B_LED_16.2 T10.1(G) U$19.27(A6)
PE_A7: R_B_LED_18.2 T8.1(G) U$19.28(A7)
RED_INSTR: R_R_LED_1.2 R_R_LED_2.2 R_R_LED_3.2 R_R_LED_4.2 R_R_LED_5.2 R_R_LED_6.2 R_R_LED_7.2 R_R_LED_8.2 R_R_LED_9.2 R_R_LED_10.2 R_R_LED_11.2 T3.3(D) T12.3(D)
REED: IC1.12(D:I0) R_REED.2 R_REED_DOWN.1 R_REED_UP.2
REED_IN: R_REED.1 SPEEDOSTECKER.P$9(REED)
RESETAVR_AT8: C9.1 IC4.47((ICP1)PD4) JP2.2 R_L3.2 U$1.29((!RESET!/PCINT14)PC6)
RX0: IC4.2((RXD0/PCIN8)PE0) RX.1
RX1: GPS.TXD(TXD_NMEA_OUT) IC4.45((RXD1/INT2)PD2)
RX3: IC4.63(PJ0(RXD3/PCINT9)) U$1.31((TXD/PCINT17)PD1)
SCK_AT8: JP2.4 U$1.17((PCINT5/SCK)PB5)
SCL: IC4.43((SCL/INT0)PD0) R_SCL_UP.2 TEMP_SENS.2(SCL) TX2.3 U$19.12(SCL)
SD_CARD_CLK: U$24.80(PC12/UART5_TX/SPI3_MOSI/USART3_CK/SDIO_CLK)
SD_CARD_CMD: U$24.83(PD2/UART5_RX/SDIO_CLD)
SD_CARD_DAT0: U$24.65(PC8/USART6_CK/TIM8CH3/TIM3CH3/SDIO_D0)
SD_CARD_DAT1: U$24.66(PC9/I2C3_SDA/TIM3CH4/SDIO_D1)
SD_CARD_DAT2: U$24.78(PC10/SPI3_SCK/UART4_TX/USART3_CK/SDIO_D2)
SD_CARD_DAT3/CD: U$24.79(PC11/UART4_RX/SPI3_MISO/USART3_RX/SDIO_D3)
SD_CD: ST2.2(DAT3/CD) U$14.11(B7)
SD_CLK: ST2.5(CLK) U$14.12(B6)
SD_DATA_IN: ST2.3(CMD) U$14.13(B5)
SDA: IC4.44((SDA/INT1)PD1) R_SDA_UP.2 TEMP_SENS.1(SDA) TX2.2 U$19.13(SDA)
SELF_PWR_UP: IC4.35(PL0(ICP4)) R_DEAKT_DAUER_P1.1 T13.1(G)
TO_DATA_LED: BLUETOOTH.P$11(P$11PIO(5)) R_DATA.2
TX: BLUETOOTH.P$27(P$27_UART-TX) RX.2
TX0: IC4.3((TXD0)PE1) TX.2
TX1: IC4.46((TXD1/INT3)PD3) R_TX_UP.2
TX1_3.3: GPS.RXD R_TX_DOWN.1 R_TX_UP.1
TX3: IC4.64(PJ1(TXD3/PCINT10)) U$1.30((RXD/PCINT16)PD0)
USART1_RX: U$24.93(PB7/I2C1_SDA/USART1_RX)
USART1_TX: U$24.92(PB6/I2C1_SCL/CAN2_TX/USART1_TX)
USART2_RX: U$24.26(PA3/USART2_RX/TIM5CH4/TIM9CH2/TIM2CH4/ADC123IN3)
USART2_TX: U$24.25(PA2/USART2_TX/TIM5CH3/TIM9CH1/TIM2CH3/ADC123IN2)
USART3_RX: U$24.48(PB11/I2C2_SDA/USART3_RX/TIM2CH4)
USART3_TX: U$24.47(PB10/I2C2_SCL/SPI2_SCK/USART3_TX/TIM2CH3)
V_AT8_BUFFERED: AT8_REF.1 C2.2 C3.2 C_EMERGENCY.PLUS D9.C JP2.5 U$1.4(VCC) U$1.6(VCC)
V_BAT: D15.C GPS.VBACKUP GPS_C2.1 GPS_D2.3(C) IC2.3(A:+IN)
VDD: 5V_F.P$1 C14.2 C22.2 C32.1 C33.1 C34.1 D9.A D_GR_BLR.P$1(ANODE) D_GR_BLR.P$2(ANODE) D_GR_BLR.P$3(ANODE) D_GR_N.P$1(ANODE) D_GR_N.P$2(ANODE) D_GR_N.P$3(ANODE) IC1.1(A:I0) IC1.8(C:I0) IC1.13(D:I1) IC1.14(P:VDD) IC2.8(P:V+) IC4.10(VCC) IC4.31(VCC1) IC4.61(VCC2) IC4.80(VCC3) IC4.100(AVCC) JP1.5 PE.2 PWR1.2 PWR.2 Q1.2(S) Q2.2(S) Q3.2(S) Q4.2(S) Q5.2(S) Q6.2(S) Q7.2(S) Q8.2(S) Q9.2(S) Q10.2(S) Q11.2(S) R_DELAY.2 R_E1_0.2 R_GR_BL_L.P$1(ANODE) R_GR_BL_L.P$2(ANODE) R_GR_BL_L.P$3(ANODE) R_L3.1 R_LED_5V.1 R_OIL_UP.2 R_REED_UP.1 R_RES_UP.2 R_SCL_UP.1 R_SDA_UP.1 R_TEMP_OS.2 R_WATER_UP.1 U4.18(VDD) U5.3(VDD) U$3.P$1(ANODE) U$3.P$2(ANODE) U$3.P$3(ANODE) U$11.P$1(ANODE) U$11.P$2(ANODE) U$11.P$3(ANODE) U$19.9(VCC) U$19.18(NOT(RESET)) U$22.P$1(ANODE) U$22.P$2(ANODE) U$22.P$3(ANODE)
WATER_TEMP_IN: U$24.34(PC5/ADC12IN15)
Unconnected: BLUETOOTH.P$3(P$3_AIO(0)) BLUETOOTH.P$4(P$4_AIO(1)) BLUETOOTH.P$5(P$5_PIO(0)) BLUETOOTH.P$6(P$6_PIO(1)) BLUETOOTH.P$7(P$7_PIO(2)) BLUETOOTH.P$8(P$8_PIO(3)) BLUETOOTH.P$9(P$9_PIO(4)) BLUETOOTH.P$12(P$12_PIO(6)) BLUETOOTH.P$14(P$14_PIO(8)) BLUETOOTH.P$15(P$15_PIO(9)) BLUETOOTH.P$16(P$16_RESET) BLUETOOTH.P$20(P$20_USB-DP) BLUETOOTH.P$21(P$21_USB-DN) BLUETOOTH.P$22(P$22_PCM-SYNC) BLUETOOTH.P$23(P$23_PCM-IN) BLUETOOTH.P$24(P$24_PCM-OUT) BLUETOOTH.P$25(P$25_PCM-CLK) BLUETOOTH.P$28(P$28_UART-RTS) BLUETOOTH.P$30(P$30_UART-CTS) BLUETOOTH.P$31(P$31_SPI-MOSI) BLUETOOTH.P$32(P$32_SPI-CSB) BLUETOOTH.P$33(P$33_SPI-CLK) BLUETOOTH.P$34(P$34_SPI-MISO) BLUETOOTH.P$35(P$35_PIO(11)) BLUETOOTH.P$36(P$36_PIO(10)) GPS.D+(DMINUS) GPS.D-(DPLUS) IC1.4(B:O) IC1.5(B:I0) IC1.6(B:I1) IC2.5(B:+IN) IC2.6(B:-IN) IC2.7(B:OUT) IC4.4((XCK0/AIN0)PE2) IC4.28((TOSC2)PG3) IC4.29((TOSC1)PG4) IC4.33(XTAL2) IC4.48((XCK1)PD5) IC4.79(PJ7) NHD_2.7.NC0(NC) NHD_2.7.NC1(NC2) NHD_2.7.NC2(NC3) NHD_2.7.NC3(NC4) R_E2_0.1 ST2.1(DAT2) ST2.8(DAT1) U4.3(CLKOUT) U4.4(TX0RTS) U4.5(TX1RTS) U4.6(TX2RTS) U4.7(OSC2) U4.10(RX1BF) U4.11(RX0BF) U5.5(VREF) U$1.8((PCINT7/XTAL2/TOSC2)PB7) U$1.12((PCINT0/CLKO/ICP1)PB0) U$1.13((PCINT1/OC1A)PB1) U$1.14((PCINT2/!SS!/OC1B)PB2) U$1.19(ADC6) U$1.22(ADC7) U$1.27((ADC4/PCINT12/SDA)PC4) U$14.2(A0) U$14.3(A1) U$14.4(A2) U$14.5(A3) U$14.6(A4) U$14.14(B4) U$14.15(B3) U$14.16(B2) U$14.17(B1) U$14.18(B0) U$19.11(NC1) U$19.14(NC2) U$19.19(INTB) U$19.20(INTA) U$23.1(TRI) U$24.1(PE2/FSMC_A23) U$24.2(PE3) U$24.3(PE4) U$24.4(PE5/TIM9CH1) U$24.5(PE6/TIM9CH2) U$24.6(VBAT) U$24.7(PC13/RTC_AF1) U$24.8(PC14/OSC32_IN) U$24.9(PC15/OSC32_OUT) U$24.10(VSS) U$24.11(VDD) U$24.12(PH0/OSC_IN) U$24.13(PH1/OSC_OUT) U$24.14(NRST) U$24.15(PC0/ADC123IN10) U$24.16(PC1/ADC123IN11) U$24.17(PC2/SPI2_MISO/ADC123IN12) U$24.18(PC3/SPI2_MOSI/ADC123IN13) U$24.19(VDD1) U$24.20(VSSA) U$24.21(VREF+) U$24.22(VDDA) U$24.23(PA0/USART2_CTS/USART4_TX/WKUP/TIM2_CH1_ETR/TIM5CH1/TIM8ETR/ADC123IN0) U$24.24(PA1/USART2_RTS/USART4_RX/TIM5CH2/TIM2CH2/ADC123IN1) U$24.27(VSS2) U$24.28(VDD2) U$24.29(PA4/SPI1_NSS/SPI3_NSS/USART2_CK/ADC12IN4/DACOUT1) U$24.30(PA5/SPI1_SCK/TIM8CH1N/ADC12IN5) U$24.31(PA6/SPI1_MISO/TIM13CH1/TIM3CH1/TIM1BKIN/ADC12IN6) U$24.32(PA7/SPI1_MOSI/TIM14CH1/TIM3CH2/ADC12IN7) U$24.33(PC4/ADC12IN14) U$24.36(PB1/TIM3CH4/ADC12IN9) U$24.37(PB2/BOOT1) U$24.38(PE7/FSMC_D4) U$24.39(PE8/FSMC_D5) U$24.49(VCAP_1) U$24.50(VDD3) U$24.51(PB12/SPI2_NSS/I2C2_SMBA/USART3_CK/CAN2_RX) U$24.52(PB13/SPI2_SCK_USART3_CTS_CAN2_TX) U$24.53(PB14/SPI2_MISO/USART3_RTS) U$24.54(PB15/SPI2_MOSI) U$24.59(PD12/USART3_RTS/FSMC_A17) U$24.60(PD13/TIM4CH2/FSMC_A18) U$24.61(PD14/TIM4CH3) U$24.62(PD15/TIM4CH4) U$24.63(PC6/USART6_TX/SDIO_D6) U$24.64(PC7/USART6_RX/SDIO_D7) U$24.67(PA8/USART1_CK/I2C3_SCL/TIM1CH1) U$24.68(PA9/USART1_TX/I2C3_SMBA) U$24.69(PA10/USART1_RX) U$24.72(PA13/JTMS/SWDIO) U$24.73(VCAP_2) U$24.74(VSS4) U$24.75(VDD4) U$24.76(PA14/JTCK/SWCLK) U$24.77(PA15/JTDI/SPI3_NSS/SPI1_NSS) U$24.81(PD0/CAN1_RX) U$24.82(PD1/CAN1_TX) U$24.84(PD3/USART2_CTS) U$24.86(PD5/USART2_TX/FSMC_NWE) U$24.87(PD6/USART2_RX) U$24.88(PD7/USART2_CK/FSMC_NE1) U$24.89(PB3/JTDO/TRACESWO/SPI3_SCK/SPI1_SCK) U$24.90(PB4/NJTRST/SPI3_MISO/SPI1_MISO) U$24.91(PB5/I2C1_SMBA/CAN2_RX/SPI1_MOSI/SPI3_MOSI) U$24.94(BOOT0) U$24.97(PE0) U$24.98(PE1) U$24.99(PDR_ON) U$24.100(VDD5)

## Notes on the sheet
- Helligkeitssensor
- Bluetooth | Connect | i2c_temp
- ATmega2560
- GPS_V_BACKUP
- oil_temp
- RGB Zeiger
- Kupplung | 12V
- CAN_CS
- CAN_INT | 12V
- MISO | Buttons
- MOSI | low active
- SCK
- SD CS | R ggn Masse
- Disp CS | 12V
- Disp Reset | low active
- Disp CD | DZ_SCHMITT | 12V
- Disp SCL | NOT(1&&2)
- HB_OUT | Disp SDA | Mccoi
- NG_OUT | Adr 2 | GPS
- BL_L_OUT
- BL_R_OUT | ARD_RX
- OIL_PR_OUT | REED_SCHMITT | Sw ggn M / Pulse?
- RESERVE_SCHMITT | ARD_TX | NOT(12&&13)
- R ggn Masse
- Mccoi | D18
- GPS_Recv | ?
- SDA
- Helligkeitssensor? | SCL | Ex_IN(12/5)
- Right Flasher
- GPS Bat (A11) | Left Flasher
- High Beam | Reed Schmitt
- Neutral Gear | DZ Schmitt | water_temp
- Oil Preasure | 1. Digitaler INOUT
- 2. Digitaler IN via Schmidt
- rx/tx BT | 3. Digitaler IN 12V
- Taster auf INT | rx/tx BT
- Taster auf INT
- Taster auf INT | A_extend
- SD
- Taster auf INT | Sensoren
- VDD | MOSI | GND
- V_bat
- Oil Temp
- Water Temp | 210
- RGB_INST
- HW06: ---
- RGB_INST
- RGB_INST | SD Power | HW07: --0 | Kupplung
- to ATmega8 | HW08: -0-
- HW09: -00
- Adr 2 | HW10: 0--
- MISO | SCK | RST | Adr 1 | HW11: 0-0
- Adr 0 | HW12: 00- | DZM
- HW13: 000
- V: 6 + (not(Adr2)<<2 || not(Adr1)<<1 || not(Ard0)<<0 )
- there is a Diode at the Port to protect it against the 12V
- Display
- ATmega328P-AU
- Instrumenten Beleuchtung | Schmitt-Trigger | PWR
- Lichtlein & Blinker
- Spacer Display - Platine 10mm | Spacer Boden - Platine 4mm M2.5
- Bluetooth toggle
- ATm2560 alive toggle
- V meas
- CAN
- CS
- SCK
- MOSI
- MISO
- RESET
- CAN_INT
- GPS
- Bluetooth | Bluetooth
- GPS
- ATm328

## Power pins joined to a net without a drawn wire
VDD: U$23.4(VDD)

## Library data of the parts
3.3V_SUPPLY 5V_SUPPLY = Kolja:OKI-78SR
5V_F 12V_F1 = Kolja:POLY_FUSE
AT8_REF R1 R10 R12 R13 R_B_LED_1-R_B_LED_20 R_BL_L R_BL_R R_DEAKT_DAUER_P R_DEAKT_DAUER_P1 R_DEAKT_DAUER_P2 R_DELAY R_DZ R_DZ_DOWN R_E1_0 R_E1_1-R_E1_4 R_E2_0 R_E2_1-R_E2_4 R_FLASHL R_FLASHL_DOWN R_FLASHR R_FLASHR_DOWN R_G_LED_1-R_G_LED_11 R_GPS_LED R_HB R_HB1 R_HB3-R_HB5 R_HB_DOWN R_HIGHB R_L0 R_L1-R_L3 R_LED_5V R_N R_OIL R_OIL_OV R_OIL_OV1 R_OIL_UP R_R_LED_0 R_R_LED_1-R_R_LED_12 R_REED R_REED_DOWN R_REED_UP R_RES_UP R_SCL_UP R_SD_PWR_UP R_SDA_UP R_TEMP_OS R_TX_DOWN R_TX_UP R_V_HIGH R_V_LOW R_WATER_UP = RCLDT:R
B_DOWN B_LEFT B_RIGHT B_UP = Kolja:SMD_TASTER_MIT_KAPPE
BLUETOOTH = btm-222:BTM-222: Rayson BTM-222 Bluetooth Modul all Pins
C1-C20 C22 C23 C31-C36 C39 GPS_C1-GPS_C5 PE = RCLDT:C
C_EMERGENCY = Kolja:DX-5R5H334U: Mouser Nr 555-DX-5R5H334U, 5.5V, 330mF, 5mm hoch, 1.05€
CP1-CP4 = Kolja:C_SMD_SMP: Mouser:667-EEE-1CA331UP
D1-D3 D6 D8 D10 D11 D13 D18 D20-D22 D_P_MCCOI = diode:ZENER-DIODE: Z-Diode
D4 D5 D_GPS_FIX D_L0 D_L1 D_L2 D_PWR_LED = OPTO:LED
D7 D12 D14 GPS_D1 GPS_D2 = semicon-smd-ipc:D-: DIODE unfilled
D9 D15 = diode:DIODE-: DIODE
D_GR_BLR D_GR_N R_GR_BL_L = Kolja:PLCC4_LED: CLM4B-GKW-CWBYA693, Mouser 941-CLM4BGKWCWBYA693, Vin 3.6 - 4.2, If 30mA, 0.223€
D_VERPOL D_VERPOL1 = RCLDT:D-S
GPS = Kolja:MT3329
GPS_BAT = SparkFun:BATTERY: Battery Holders Various common sizes : AA, AAA, 20mm coin cell and 12mm coin cell.
IC1 = 40xx:4093: Quad 2-input NAND schmitt trigger
IC2 = linear:*1458: OP AMP
IC4 = atmel-2005:ATMEGA*: MICROCONTROLLER 64/128/256 Kbytes FLASH 4 Kbytes EEPROM 8 Kbytes SRAM 86 General Purpose I/O pins 12-channels16-bit PWM 4 x Serial USARTs 16-channels 10-bit A/D
JP1 JP2 = pinhead:PINHD-2X3: PIN HEADER
L8 L10 = RCLDT:L
NHD_2.7 = Kolja:NHD_2.7_SOLO_RO
PWR TX2 = pinhead:PINHD-1X3: PIN HEADER
PWR1 RX RX1 TX = pinhead:PINHD-1X2: PIN HEADER
Q1-Q11 = transistor-small-signal:BSS84: P-CHANNEL MOS FET
R_CNT R_DATA = rcl:R-EU_: RESISTOR, European symbol
RGB_1-RGB_11 = Kolja:RGB_LED: Mouser 720-LRTBGFTMST729Q5R, 0.6€, 2.0V 40mA Red, 3.0V 20mA Blue, 3.2V 20mA Green
RX_H RX_L = resistor:R-EU_: RESISTOR, European symbol
S1 = SWITCH+RELAIS:SW-TASTER
SPEEDOSTECKER = Kolja:SPEEDOSTECKER
ST2 = Kolja:SD_MICRO
STEPPER = Kolja:STEPPER
T1-T3 T6-T13 = Kolja:2N7002: Mouser: 771-2N7002BK215 , N-Channel, 60V 350mA, SOT-23, 0,052€
T5 = RCLDT:T-P-FET
T_P_BRIDGE T_P_BRIDGE1 = Kolja:PMV160UP215: PMV160UP215, - 1.2 A, 210mOhm Rds on, 0,061€
TEMP_SENS = Kolja:SE95D: Mouser 771-SE95D118, 0,559€, SOIC8
U4 = microchip_can:MCP2510
U5 = skpang_lib:MCP2551
U$1 = Kolja:ATMEGA328P-AU
U$3 = Kolja:CLM4B-BKW-CTBVA363: Mouser: 941-CLM4BBKWCTBVA363, BLUE, 3.6V | 30ma, 550mcd, 0.198€
U$11 U$22 = Kolja:CLM4B-RKW-CWAXBAA3: Mouser 941-CLM4BRKWCWAXBAA3, RED, 1600mcd, 0.124 €, 2.4V | 50mA
U$14 = Kolja:74LVC_LVCH245A
U$19 = Kolja:MCP23017: Mouser: MCP23017-E/SO, 1,07€
U$23 = crystal:ASE: 3.3Vdc CMOS SMD CRYSTAL CLOCK OSCILLATOR SOurce: www.abracon.com; OC_FARNELL: unknown; OC_NEWARK: unknown
U$24 = STM32F407Vx_LQFP100:STM32F407VX: STmicroelectronics Cortex M4 Series Typ: STM32F407Vx LQFP100 Copyright 2012 by Ersan Günes, Quantitec, info@quantitec.de

## Net classes
0 default: width 0.18 mm, drill 0.3 mm, clearance 0.15 mm